# EAGLE design M_A_base (EAGLE 9.6.2)
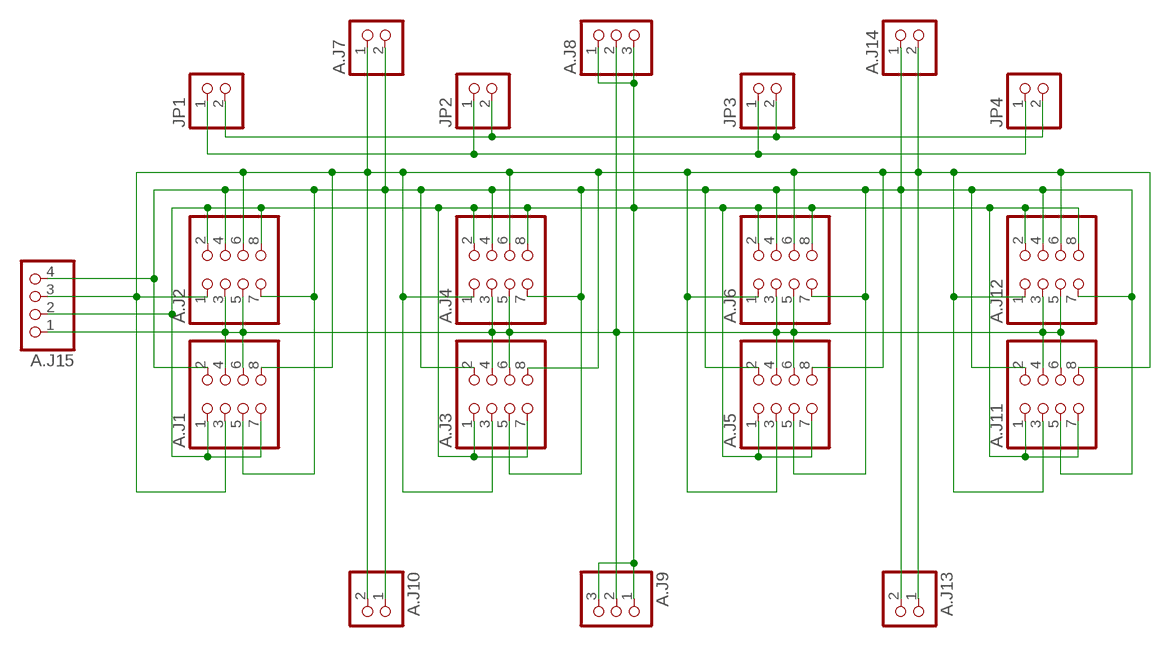
[diagram p0: schematic, sheet 1]

## Parts
A.J1  PINHD-2X4  [2X04]
A.J2  PINHD-2X4  [2X04]
A.J3  PINHD-2X4  [2X04]
A.J4  PINHD-2X4  [2X04]
A.J5  PINHD-2X4  [2X04]
A.J6  PINHD-2X4  [2X04]
A.J7  PINHD-1X2/90  [1X02/90]
A.J8  PINHD-1X3/90  [1X03/90]
A.J9  PINHD-1X31X03/90F  [1X03/90F]
A.J10  PINHD-1X21X02/90F  [1X02/90F]
A.J11  PINHD-2X4  [2X04]
A.J12  PINHD-2X4  [2X04]
A.J13  PINHD-1X21X02/90F  [1X02/90F]
A.J14  PINHD-1X2/90  [1X02/90]
A.J15  PINHD-1X4  [1X04]
JP1  PINHD-1X2  [1X02]
JP2  PINHD-1X2  [1X02]
JP3  PINHD-1X2  [1X02]
JP4  PINHD-1X2  [1X02]

## Nets
GND: A.J1.1 A.J1.7 A.J2.2 A.J2.8 A.J3.1 A.J3.7 A.J4.2 A.J4.8 A.J5.1 A.J5.7 A.J6.2 A.J6.8 A.J8.1 A.J8.3 A.J9.1 A.J9.3 A.J11.1 A.J11.7 A.J12.2 A.J12.8 A.J15.2
SCL: A.J1.2 A.J1.5 A.J2.4 A.J2.7 A.J3.2 A.J3.5 A.J4.4 A.J4.7 A.J5.2 A.J5.5 A.J6.4 A.J6.7 A.J7.2 A.J10.1 A.J11.2 A.J11.5 A.J12.4 A.J12.7 A.J13.2 A.J14.1 A.J15.4
SDA: A.J1.3 A.J1.8 A.J2.1 A.J2.6 A.J3.3 A.J3.8 A.J4.1 A.J4.6 A.J5.3 A.J5.8 A.J6.1 A.J6.6 A.J7.1 A.J10.2 A.J11.3 A.J11.8 A.J12.1 A.J12.6 A.J13.1 A.J14.2 A.J15.3
VBAT: JP1.2 JP2.2 JP3.2 JP4.2
VCC: A.J1.4 A.J1.6 A.J2.3 A.J2.5 A.J3.4 A.J3.6 A.J4.3 A.J4.5 A.J5.4 A.J5.6 A.J6.3 A.J6.5 A.J8.2 A.J9.2 A.J11.4 A.J11.6 A.J12.3 A.J12.5 A.J15.1
VUSB: JP1.1 JP2.1 JP3.1 JP4.1

## Library data of the parts
A.J1-A.J6 A.J11 A.J12 = pinhead2:PINHD-2X4: PIN HEADER
A.J7 A.J10 A.J13 A.J14 JP1-JP4 = pinhead2:PINHD-1X2: PIN HEADER
A.J8 A.J9 = pinhead2:PINHD-1X3: PIN HEADER
A.J15 = pinhead2:PINHD-1X4: PIN HEADER

## Board
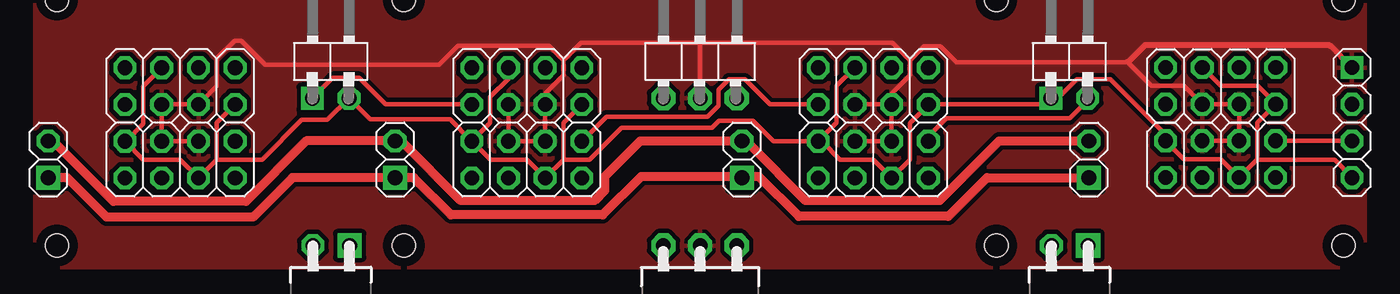
[diagram p1: board, top side]
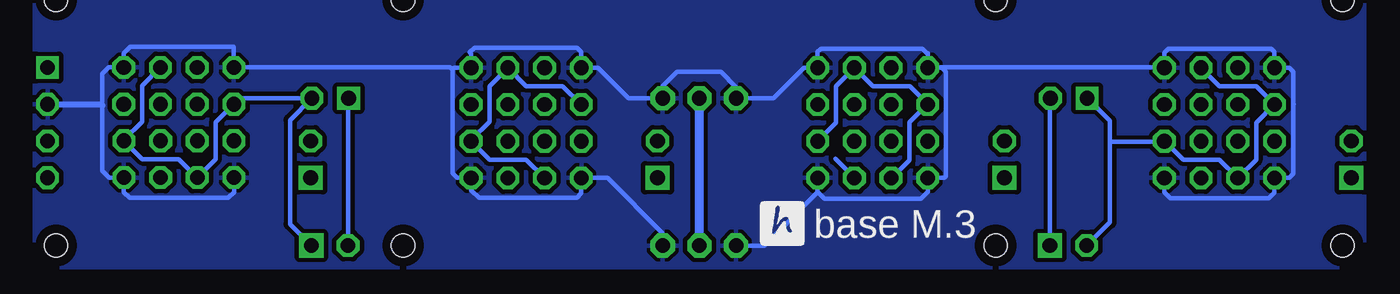
[diagram p2: board, bottom side, seen from below]

No outline drawn. Coordinates in mm, seen from the top.
Copper layers (1*16): Top 0.035mm / dielectric 1.5mm / Bottom 0.035mm
Design rules "default *": minimum track width 12mil, minimum drill 0.35mm, track to track 11mil, track to pad 11mil, pad to pad 11mil, via to via 11mil, smd to smd 11mil, copper to edge 0mil, drill to drill 15mil, minimum pad ring 10mil, minimum via ring 8mil, stop-mask expansion 4mil, vias tented up to drill 0mil, thermal gap 10mil
Holes 1.6 mm at 91,2 91,19 2,19 2,2 67,19 67,2 26,19 26,2
tRestrict: area 1,18 to 3,20; area 1,1 to 3,3; area 90,18 to 92,20; area 90,1 to 92,3; area 66,18 to 68,20; area 66,1 to 68,3; area 25,1 to 27,3; area 25,18 to 27,20
bRestrict: area 1,1 to 3,3; area 1,18 to 3,20; area 90,1 to 92,3; area 90,18 to 92,20; area 66,18 to 68,20; area 66,1 to 68,3; area 25,1 to 27,3; area 25,18 to 27,20

### Footprints (pad centres in the part's own frame; a part is rotated, then mirrored left to right if it is on the bottom)
2X04 = drill 1.016 pad 1.575 octagon: 1 -3.81,-1.27; 2 -3.81,1.27; 3 -1.27,-1.27; 4 -1.27,1.27; 5 1.27,-1.27; 6 1.27,1.27; 7 3.81,-1.27; 8 3.81,1.27
1X02/90 = drill 1.016 pad 1.575 square: 1 -1.27,-3.81 | drill 1.016 pad 1.575 octagon: 2 1.27,-3.81
1X03/90 = drill 1.016 pad 1.676 octagon: 1 -2.54,-3.81; 2 0,-3.81; 3 2.54,-3.81
1X03/90F = drill 1.016 pad 1.676 octagon: 1 -2.54,0; 2 0,0; 3 2.54,0
1X02/90F = drill 1.016 pad 1.676 square: 1 -1.31,0 | drill 1.016 pad 1.575 octagon: 2 1.23,0
1X04 = drill 1.016 pad 1.575 square: 1 -3.81,0 | drill 1.016 pad 1.575 octagon: 2 -1.27,0; 3 1.27,0; 4 3.81,0
1X02 = drill 1.016 pad 1.676 square: 1 -1.27,0 | drill 1.016 pad 1.575 octagon: 2 1.27,0

### Placement (x,y rotation side)
A.J1  10.52,13.03 180 top
A.J2  10.52,7.95 180 top
A.J3  34.51,13.03 180 top
A.J4  34.51,7.95 180 top
A.J5  58.48,13.03 180 top
A.J6  58.48,7.95 180 top
A.J7  20.94,16 0 top
A.J8  46.5,16 0 top
A.J9  46.5,2 180 top
A.J10  20.94,2 180 top
A.J11  82.51,7.97 0 top
A.J12  82.52,13.05 0 top
A.J13  72.04,2 180 top
A.J14  72.04,16 0 top
A.J15  91.6,10.5 270 top
JP1  1.4,7.96 90 top
JP2  25.4,7.96 90 top
JP3  49.4,7.96 90 top
JP4  73.4,7.96 90 top

### Tracks (layer width: path | path; a pad name or v marks a point on that pad's centre or on a via)
GND
  Bottom 0.305: A.J5.7 54.67,15.39 54.98,15.69 62.06,15.69 62.39,15.36 62.29,15.26 A.J5.1 63.46,14.3 63.59,14.17 | A.J5.7 54.67,14.88 | A.J3.7 30.7,14.32 14.33,14.32 A.J1.1 14.33,15.35 14.07,15.62 6.92,15.62 6.71,15.41 A.J1.7 5.7,14.3 5.41,14 5.41,11.79 | 30.7,15.24 31.08,15.62 38.09,15.62 38.32,15.39 A.J3.1 39.26,14.3 41.37,12.19 A.J8.1 43.96,12.96 45.01,14.01 48.06,14.01 49.04,13.03 A.J8.3 51.42,12.19 53.53,14.3 A.J5.7 | A.J3.7 29.71,14.3 29.43,14.02 29.43,6.8 29.56,6.68 A.J4.8 30.7,5.71 31.18,5.23 37.84,5.23 38.32,5.71 38.32,6 A.J4.2 38.32,5.68 42,2 A.J9.3 | 14.35,5.76 14.33,5.8 A.J2.2 14.33,5.67 13.91,5.25 7.11,5.25 6.71,5.65 A.J2.8 5.7,6.68 5.41,6.97 5.41,9.22 | 5.41,11.79 5.41,9.22 | 63.59,14.17 63.59,7.01 63.26,6.68 A.J6.2 62.29,5.84 61.76,5.3 54.98,5.3 54.67,5.61 A.J6.8 | A.J6.8 54.67,6.04 | A.J3.7 30.7,15.31 | A.J11.1 78.7,5.7 79.09,5.31 85.93,5.31 86.32,5.7 A.J11.7 87.32,6.7 87.8,7.18 87.8,11.68 87.8,13.88 87.36,14.31 A.J12.8 86.33,15.31 85.88,15.76 78.71,15.76 A.J12.2 63.73,14.31 63.59,14.17 | A.J9.1 49.04,2.85 52.87,6.68 A.J6.8 | 5.4,9.23 5.41,9.22 | 5.39,11.77 5.41,11.79
  Bottom 0.406: A.J15.2 87.89,11.77 87.8,11.68
  pour Bottom (isolate 0.305): 92.5,0.5 0.5,0.5 0.5,20.5 92.5,20.5
SCL
  Top 0.305: A.J4.7 30.72,9.22 31.99,7.95 34.51,7.95 A.J4.4 37.05,7.95 | A.J4.7 30.7,9.16 | A.J6.7 55.94,10.49 55.94,13.04 A.J5.5 | 62.29,11.74 A.J5.2 | 85.05,7.97 A.J11.5 83.78,6.72 82.53,7.97 79.97,7.97 A.J11.2 78.7,9.69 74.88,13.51 72.57,13.51 71.25,12.19 A.J14.1 70.34,11.76 A.J5.2 | 85.05,7.97 85.05,10.5 A.J12.7 85.86,12.24 85.86,12.26 85.08,13.04 82.52,13.04 A.J12.4 | A.J1.2 13.06,10.49 13.06,7.93 | 13.06,7.93 11.81,6.68 A.J2.4 11.79,6.69 10.54,7.95 7.98,7.95 A.J2.7 6.78,9.22 7.98,10.42 7.98,13.03 A.J1.5 | A.J3.2 37.05,10.49 37.05,7.95 | A.J6.7 54.91,9.22 56.19,7.95 58.48,7.95 A.J6.4 61.02,7.95 61.02,10.47 61.98,11.43 62.26,11.43 62.29,11.46 A.J5.2 | A.J3.5 33.24,13.55 31.97,12.28 31.97,10.49 A.J4.7 | A.J13.2 70.83,2 | 13.06,7.93 16.18,7.93 18.95,10.69 20.71,10.69 A.J7.2 23.69,10.72 29.2,10.72 A.J4.7 | 37.05,7.95 37.1,8 | 37.05,7.95 38.84,7.95 41.05,10.16 47.32,10.16 47.8,10.64 50.15,10.64 51.58,9.22 A.J6.7 | 85.05,7.97 85.1,7.92 90.4,7.92 91.6,6.72 A.J15.4
  Bottom 0.305: A.J14.1 70.81,12.15 A.J13.2 | A.J7.2 22.24,12.19 A.J10.1 | 37.1,8 A.J4.4
SDA
  Top 0.305: A.J14.2 73.31,12.03 72.07,10.79 63.54,10.79 62.29,9.55 A.J6.1 | A.J3.8 24.76,11.76 22.91,13.6 21.07,13.6 19.67,12.21 A.J7.1 | 54.67,11.72 A.J5.8 51.32,11.76 49.59,13.48 48.49,13.48 47.77,12.77 47.77,11.66 47.03,10.92 40.02,10.92 A.J4.1 | A.J15.3 A.J11.8
  Top 0.406: A.J11.8
  Bottom 0.305: 9.28,6.68 A.J2.6 | A.J4.6 33.19,6.68 31.97,7.89 31.97,10.51 30.72,11.76 A.J3.8 30.7,11.77 31.95,13.03 34.51,13.03 A.J3.3 35.78,14.29 37.05,13.02 37.05,10.49 A.J4.1 | A.J5.8 54.7,11.76 55.97,13.03 58.48,13.03 A.J5.3 61.02,13.03 61.02,10.57 62.29,9.3 A.J6.1 61.02,7.95 58.48,7.95 A.J6.6 | A.J12.6 85.06,13.04 85.06,10.56 86.32,9.3 A.J11.8 85.05,7.97 82.52,7.97 A.J11.3 79.97,7.97 79.97,10.52 A.J12.1 78.71,11.8 78.32,12.19 A.J14.2 74.83,10.68 74.83,3.48 A.J13.1 | A.J1.3 10.52,13.03 7.97,13.03 6.71,11.77 A.J1.8 7.98,10.49 7.98,7.93 9.24,6.68 A.J2.6 | A.J2.6 10.52,7.95 13.03,7.95 14.3,9.22 A.J2.1 14.36,9.19 18.1,9.19 | A.J7.1 18.1,10.62 18.1,9.19 | A.J10.2 18.1,3.61 18.1,9.19
VBAT
  Top 0.305: JP3.2 49.67,9.23
  Top 0.61: JP4.2 67.2,9.23 63.07,5.1 53.8,5.1 49.94,8.96 49.67,9.23 42.37,9.23 39.89,6.75 39.89,5.81 39.19,5.1 29.93,5.1 25.81,9.23 JP2.2 19.26,9.23 15.08,5.05 5.9,5.05 1.72,9.23 JP1.2
VCC
  Top 0.305: A.J2.5 A.J1.6 A.J1.4 13.06,13.03 13.06,14.96 14.28,16.18 14.73,16.18 16.41,14.5 28.45,14.5 29.77,15.82 36.05,15.82 36.94,14.94 | A.J2.5 | A.J2.5 A.J2.3 | A.J5.6 A.J5.4 | A.J5.4 A.J6.3 A.J6.5 | A.J3.6 A.J4.5 A.J4.3 A.J3.4 35.78,12.5 37.05,13.77 37.05,14.82 36.94,14.94 | A.J11.4 A.J11.6 A.J12.5 A.J12.3 79.98,13.04 77.72,13.04 76.09,14.68 64.24,14.68 63.13,15.79 61.98,15.79 61.02,14.82 | A.J5.4 59.75,12.5 61.02,13.77 61.02,14.82 | 36.94,14.94 37.16,14.94 38.26,16.03 46.5,16.03 | 61.02,14.82 59.81,16.03 46.5,16.03 | A.J8.2 46.5,16.03
  Top 0.406: A.J15.1 90.06,15.85 77.26,15.85 76.09,14.68
  Bottom 0.61: A.J8.2 46.52,12.17 46.52,2.02 A.J9.2
  pour Top (isolate 0.305): 0.5,20.5 92.5,20.5 92.5,0.5 0.5,0.5
VUSB
  Top 0.61: JP4.1 66.35,6.69 63.67,4.01 53.33,4.01 50.55,6.79 49.5,6.79 JP3.1 49.3,6.79 42.43,6.79 39.76,4.12 29.26,4.12 26.69,6.69 JP2.1 18.31,6.69 15.57,3.96 5.43,3.96 2.7,6.69 JP1.1

### Text on the board
bPlace: base M.3